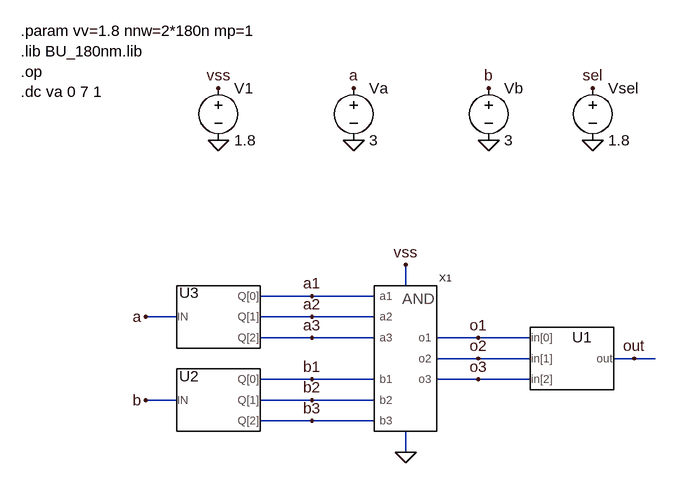
[diagram p0: schematic and3b_test.asc]
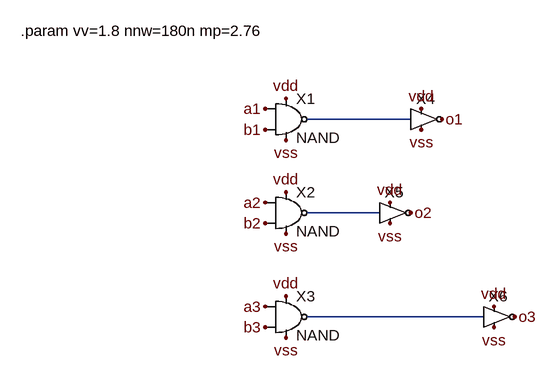
[diagram p1: sub-circuit and3b.asc]
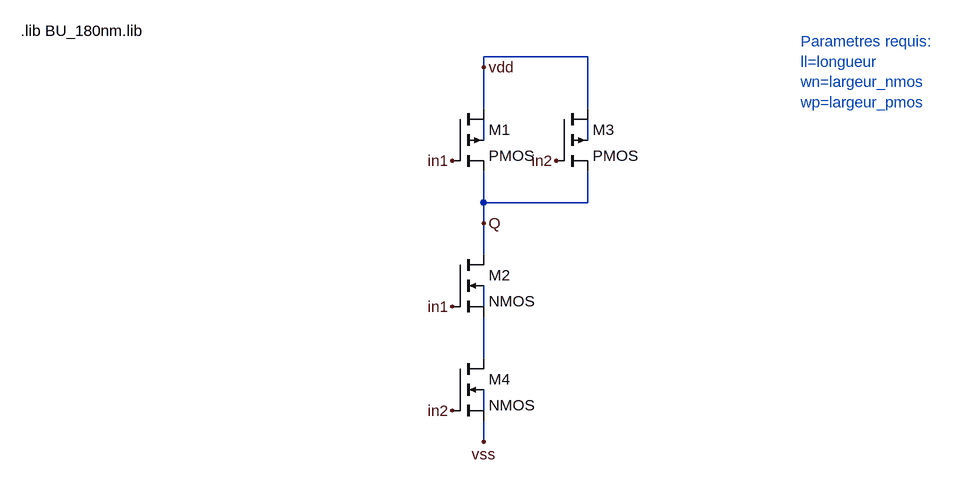
[diagram p2: sub-circuit nand.asc]
and3b_test.asc, the LTspice schematic file:
Version 4
SHEET 1 880 680
WIRE 432 208 432 176
WIRE 288 224 208 224
WIRE 384 224 288 224
WIRE 80 256 32 256
WIRE 288 256 208 256
WIRE 384 256 288 256
WIRE 288 288 208 288
WIRE 384 288 288 288
WIRE 544 288 480 288
WIRE 624 288 544 288
WIRE 544 320 480 320
WIRE 624 320 544 320
WIRE 784 320 752 320
WIRE 816 320 784 320
WIRE 288 352 208 352
WIRE 384 352 288 352
WIRE 544 352 480 352
WIRE 624 352 544 352
WIRE 80 384 32 384
WIRE 288 384 208 384
WIRE 384 384 288 384
WIRE 288 416 208 416
WIRE 384 416 288 416
WIRE 432 464 432 432
FLAG 784 320 out
FLAG 432 176 vss
FLAG 432 464 0
FLAG 144 -16 0
FLAG 352 -16 0
FLAG 560 -16 0
FLAG 144 -96 vss
FLAG 352 -96 a
FLAG 560 -96 b
FLAG 32 256 a
FLAG 32 384 b
FLAG 720 -16 0
FLAG 720 -96 sel
FLAG 544 288 o1
FLAG 544 320 o2
FLAG 544 352 o3
FLAG 288 224 a1
FLAG 288 256 a2
FLAG 288 288 a3
FLAG 288 352 b1
FLAG 288 384 b2
FLAG 288 416 b3
SYMBOL Bin2Dec 688 320 R0
SYMATTR InstName U1
SYMATTR SpiceLine Vhigh={vv}
SYMBOL Dec2Bin 144 384 R0
SYMATTR InstName U2
SYMATTR SpiceLine Vhigh={vv}
SYMBOL Dec2Bin 144 256 R0
SYMATTR InstName U3
SYMATTR SpiceLine Vhigh={vv}
SYMBOL /voltage 144 -112 R0
SYMATTR InstName V1
SYMATTR Value 1.8
SYMBOL /voltage 352 -112 R0
SYMATTR InstName Va
SYMATTR Value 3
SYMBOL /voltage 560 -112 R0
SYMATTR InstName Vb
SYMATTR Value 3
SYMBOL /voltage 720 -112 R0
SYMATTR InstName Vsel
SYMATTR Value 1.8
SYMBOL and3b 432 320 R0
SYMATTR InstName X1
TEXT -160 -184 Left 2 !.param vv=1.8 nnw=2*180n mp=1\n.lib BU_180nm.lib\n.op\n.dc va 0 7 1

and3b.asc, the sub-circuit schematic file:
Version 4
SHEET 1 1616 1032
WIRE 704 80 544 80
WIRE 656 224 544 224
WIRE 816 384 544 384
FLAG 480 64 a1
FLAG 480 208 a2
FLAG 480 368 a3
FLAG 480 96 b1
FLAG 480 240 b2
FLAG 480 400 b3
FLAG 752 80 o1
FLAG 704 224 o2
FLAG 864 384 o3
FLAG 720 64 vdd
FLAG 512 112 vss
FLAG 512 256 vss
FLAG 512 416 vss
FLAG 832 400 vss
FLAG 672 240 vss
FLAG 720 96 vss
FLAG 672 208 vdd
FLAG 832 368 vdd
FLAG 512 352 vdd
FLAG 512 192 vdd
FLAG 512 48 vdd
SYMBOL nand 512 80 R0
SYMATTR InstName X1
SYMATTR SpiceLine ll=180n wn={nnw} wp={nnw*mp}
SYMBOL nand 512 224 R0
SYMATTR InstName X2
SYMATTR SpiceLine ll=180n wn={nnw} wp={nnw*mp}
SYMBOL nand 512 384 R0
SYMATTR InstName X3
SYMATTR SpiceLine ll=180n wn={nnw} wp={nnw*mp}
SYMBOL inv 720 80 R0
SYMATTR InstName X4
SYMATTR SpiceLine ll=180n wn={nnw} wp={nnw*mp}
SYMBOL inv 672 224 R0
SYMATTR InstName X5
SYMATTR SpiceLine ll=180n wn={nnw} wp={nnw*mp}
SYMBOL inv 832 384 R0
SYMATTR InstName X6
SYMATTR SpiceLine ll=180n wn={nnw} wp={nnw*mp}
TEXT 104 -56 Left 2 !.param vv=1.8 nnw=180n mp=2.76

nand.asc, the sub-circuit schematic file:
Version 4
SHEET 1 1192 836
WIRE 608 160 448 160
WIRE 448 176 448 160
WIRE 448 240 448 176
WIRE 608 240 608 160
WIRE 448 288 448 256
WIRE 608 288 608 256
WIRE 448 384 448 336
WIRE 608 384 608 336
WIRE 608 384 448 384
WIRE 448 416 448 384
WIRE 448 464 448 416
WIRE 448 544 448 512
WIRE 448 624 448 560
WIRE 448 704 448 672
WIRE 448 752 448 720
FLAG 448 176 vdd
FLAG 448 416 Q
FLAG 400 320 in1
FLAG 560 320 in2
FLAG 400 544 in1
FLAG 400 704 in2
FLAG 448 752 vss
SYMBOL pmos4 400 240 R0
SYMATTR InstName M1
SYMATTR Value2 l={ll} w={wp} ad={450n*{wp}} as={450n*{wp}} pd={900n+{wp}} ps={1080n+{wp}}
SYMBOL pmos4 560 240 R0
SYMATTR InstName M3
SYMATTR Value2 l={ll} w={wp} ad={450n*{wp}} as={450n*{wp}} pd={900n+{wp}} ps={1080n+{wp}}
SYMBOL nmos4 400 464 R0
SYMATTR InstName M2
SYMATTR Value2 l={ll} w={2*wn} ad={450n*{wn}} as={450n*{wn}} pd={900n+{wn}} ps={1080n+{wn}}
SYMBOL nmos4 400 624 R0
SYMATTR InstName M4
SYMATTR Value2 l={ll} w={2*wn} ad={450n*{wn}} as={450n*{wn}} pd={900n+{wn}} ps={1080n+{wn}}
TEXT -264 120 Left 2 !.lib BU_180nm.lib
TEXT 936 136 Left 2 ;Parametres requis: \nll=longueur \nwn=largeur_nmos \nwp=largeur_pmos

The netlist it stands for:
* and3b_test.asc
XU1 o1 o2 o3 out Bin2Dec Vhigh={vv}  ; pins in[0] in[1] in[2] out
XU2 b b1 b2 b3 Dec2Bin Vhigh={vv}  ; pins IN Q[0] Q[1] Q[2]
XU3 a a1 a2 a3 Dec2Bin Vhigh={vv}  ; pins IN Q[0] Q[1] Q[2]
V1 vss 0 1.8
Va a 0 3
Vb b 0 3
Vsel sel 0 1.8
XX1 vss a1 a2 a3 b1 b2 b3 0 o1 o2 o3 and3b

* block symbol definitions
.subckt and3b vdd a1 a2 a3 b1 b2 b3 vss o1 o2 o3
XX1 a1 N001 vdd vss b1 nand params: NAND ll=180n wn={nnw} wp={nnw*mp}
XX2 a2 N002 vdd vss b2 nand params: NAND ll=180n wn={nnw} wp={nnw*mp}
XX3 a3 N003 vdd vss b3 nand params: NAND ll=180n wn={nnw} wp={nnw*mp}
XX4 N001 o1 vdd vss inv ll=180n wn={nnw} wp={nnw*mp}  ; pins In _Q vdd vss
XX5 N002 o2 vdd vss inv ll=180n wn={nnw} wp={nnw*mp}  ; pins In _Q vdd vss
XX6 N003 o3 vdd vss inv ll=180n wn={nnw} wp={nnw*mp}  ; pins In _Q vdd vss
.param vv=1.8 nnw=180n mp=2.76
.ends and3b

.subckt nand in1 Q vdd vss in2
M1 vdd in1 Q N001 PMOS l={ll} w={wp} ad={450n*{wp}} as={450n*{wp}} pd={900n+{wp}} ps={1080n+{wp}}
M3 vdd in2 Q N002 PMOS l={ll} w={wp} ad={450n*{wp}} as={450n*{wp}} pd={900n+{wp}} ps={1080n+{wp}}
M2 Q in1 N004 N003 NMOS l={ll} w={2*wn} ad={450n*{wn}} as={450n*{wn}} pd={900n+{wn}} ps={1080n+{wn}}
M4 N004 in2 vss N005 NMOS l={ll} w={2*wn} ad={450n*{wn}} as={450n*{wn}} pd={900n+{wn}} ps={1080n+{wn}}
.lib BU_180nm.lib
* Parametres requis:
* ll=longueur
* wn=largeur_nmos
* wp=largeur_pmos
.ends nand

.model NMOS NMOS
.model PMOS PMOS
.lib standard.mos
.param vv=1.8 nnw=2*180n mp=1
.lib BU_180nm.lib
.op
.dc va 0 7 1
.lib Bin2Dec.sub
.lib Dec2Bin.sub
.lib and3b.asc
.backanno
.end

* Results of the author's LTspice run, read from the files saved beside the schematic
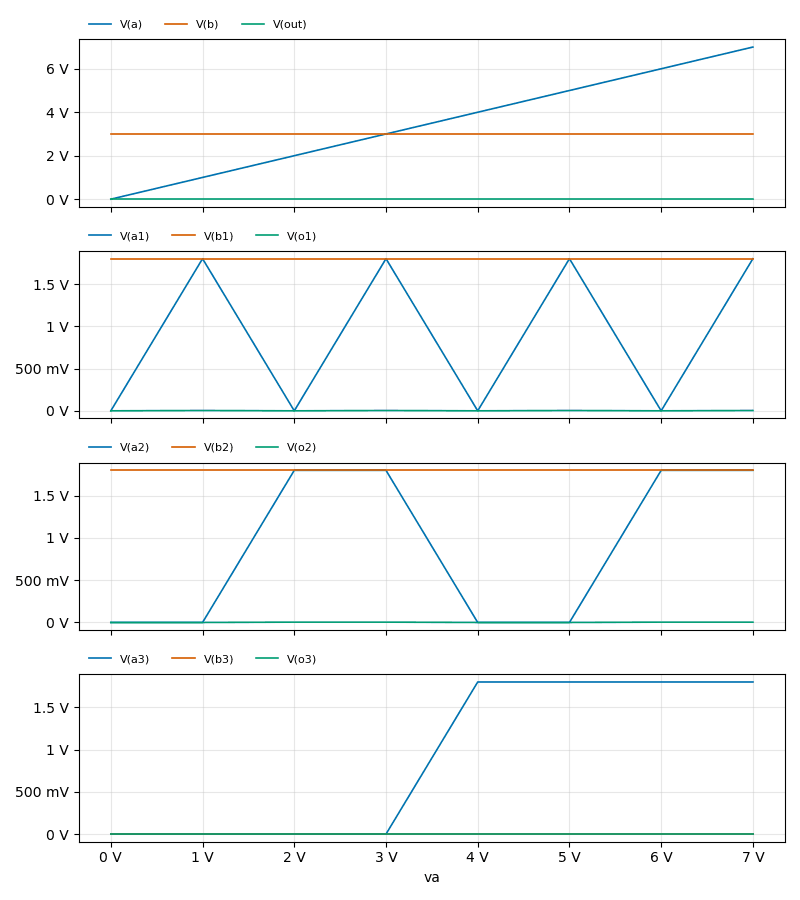
[diagram p3: DC transfer characteristic of and3b_test.asc, plotted from the saved traces]
* DC transfer characteristic, 1 run:
*   V(a): 0 V at va=0 V, 7 V at va=7 V, min 0 V, max 7 V
*   V(b): 3 V at va=0 V, 3 V at va=7 V, min 3 V, max 3 V
*   V(out): 0 V at va=0 V, 0 V at va=7 V, min 0 V, max 0 V
*   V(a1): 0 V at va=0 V, 1.8 V at va=7 V, min 0 V, max 1.8 V
*   V(b1): 1.8 V at va=0 V, 1.8 V at va=7 V, min 1.8 V, max 1.8 V
*   V(o1): 12.02 nV at va=0 V, 3.949 mV at va=7 V, min 12.02 nV, max 3.949 mV
*   V(a2): 0 V at va=0 V, 1.8 V at va=7 V, min 0 V, max 1.8 V
*   V(b2): 1.8 V at va=0 V, 1.8 V at va=7 V, min 1.8 V, max 1.8 V
*   V(o2): 12.02 nV at va=0 V, 3.949 mV at va=7 V, min 12.02 nV, max 3.949 mV
*   V(a3): 0 V at va=0 V, 1.8 V at va=7 V, min 0 V, max 1.8 V
*   V(b3): 0 V at va=0 V, 0 V at va=7 V, min 0 V, max 0 V
*   V(o3): 12.02 nV at va=0 V, 12.02 nV at va=7 V, min 12.02 nV, max 12.02 nV